# EAGLE design RSeries Lifter v17 (EAGLE 6.4)
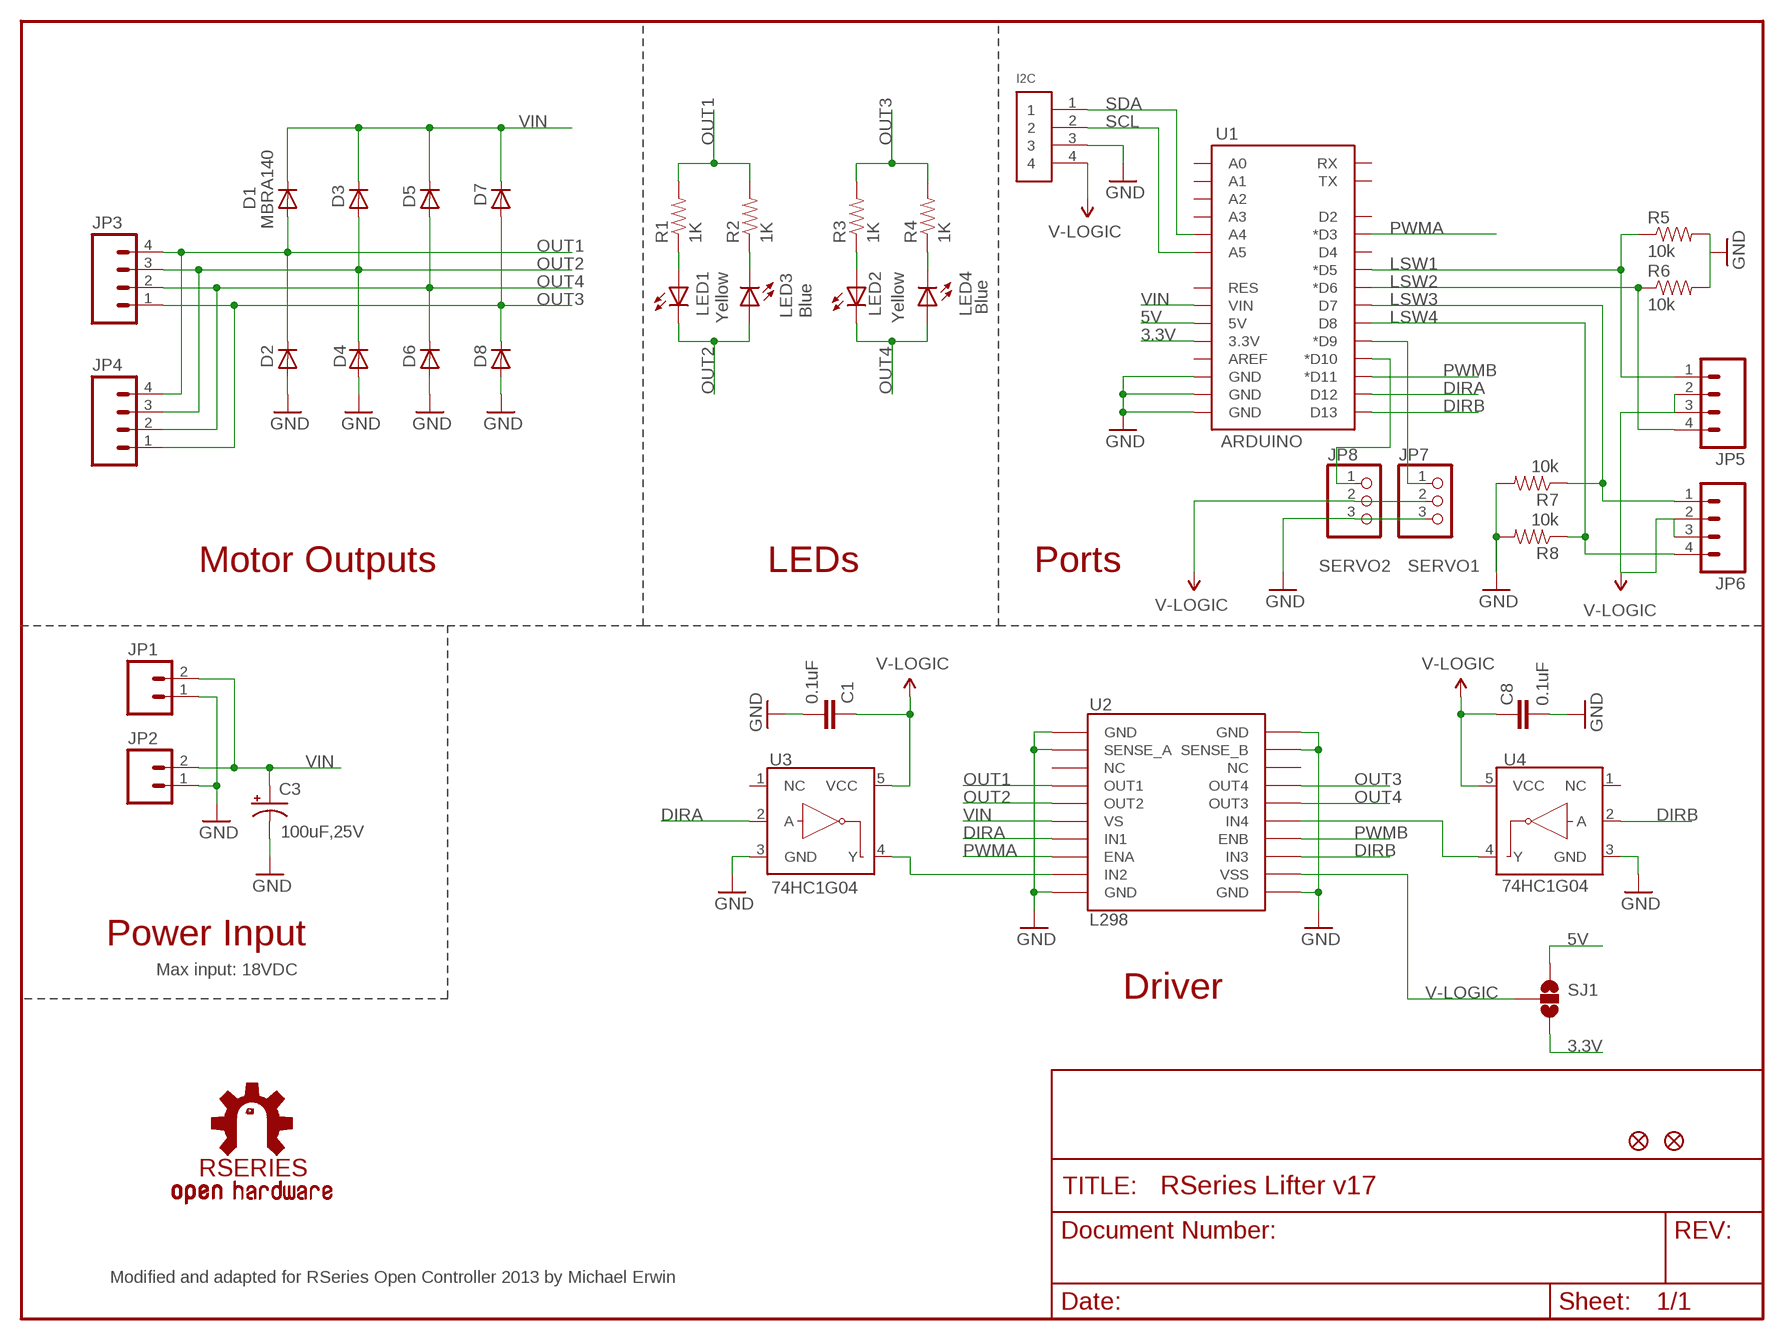
[diagram p0: schematic, sheet 1]

## Parts
C1  0.1uF  CAP0402-CAP  [0402-CAP]
C3  100uF,25V  CAP_POLF80  [NIPPON_F80]
C8  0.1uF  CAP0402-CAP  [0402-CAP]
D1  MBRA140  DIODESMA  [SMA-DIODE]
D2  MBRA140  DIODESMA  [SMA-DIODE]
D3  MBRA140  DIODESMA  [SMA-DIODE]
D4  MBRA140  DIODESMA  [SMA-DIODE]
D5  MBRA140  DIODESMA  [SMA-DIODE]
D6  MBRA140  DIODESMA  [SMA-DIODE]
D7  MBRA140  DIODESMA  [SMA-DIODE]
D8  MBRA140  DIODESMA  [SMA-DIODE]
I2C  1X4-CLEANBIG  [1X04-CLEANBIG]
JP1  M02PTH  [1X02]
JP2  M023.5MM  [SCREWTERMINAL-3.5MM-2]
JP3  M04SCREW  [SCREWTERMINAL-3.5MM-4]
JP4  M04PTH  [1X04]
JP5  M04SCREW  [SCREWTERMINAL-3.5MM-4]
JP6  M04SCREW  [SCREWTERMINAL-3.5MM-4]
JP7  PINHD-1X3CB  [1X03-CLEANBIG]
JP8  PINHD-1X3CB  [1X03-CLEANBIG]
LED1  Yellow  LED1206  [LED-1206]
LED2  Yellow  LED1206  [LED-1206]
LED3  Blue  LED1206  [LED-1206]
LED4  Blue  LED1206  [LED-1206]
R1  1K  RESISTOR  [0805]
R2  1K  RESISTOR  [0805]
R3  1K  RESISTOR  [0805]
R4  1K  RESISTOR  [0805]
R5  10k  RESISTOR0805-RES  [0805]
R6  10k  RESISTOR0805-RES  [0805]
R7  10k  RESISTOR0805-RES  [0805]
R8  10k  RESISTOR0805-RES  [0805]
SJ1  SOLDERJUMPER_2WAYPASTE1&2  [SJ_3_PASTE1&2]
U1  ARDUINO  ARDUINO_SHIELDNOLABELS  [DUEMILANOVE_SHIELD_NOLABELS]
U2  L298  L298_BRIDGE_DRIVER  [POWERSO20]
U3  74HC1G04  INVERTER  [SOT23-5]
U4  74HC1G04  INVERTER  [SOT23-5]
U$3  FIDUCIAL1X2  [FIDUCIAL-1X2]
U$4  FIDUCIAL1X2  [FIDUCIAL-1X2]
U$7  RSERIES-OSHW-LOGOMEDIUM  [RSERIES-OSHW-LOGO-MEDIUM]

## Nets
3.3V: SJ1.3 U1.3.3V
5V [power]: I2C.4 JP5.2 JP5.3 JP6.2 JP6.3 JP7.2 JP8.2 SJ1.1 U1.5V ; supply symbol labelled V-LOGIC
DIRA: U1.D12 U2.P$7(IN1) U3.2(A)
DIRB: U1.D13 U2.P$13(IN3) U4.2(A)
GND [power]: C1.2 C3.- C8.2 D2.A D4.A D6.A D8.A I2C.3 JP1.1 JP2.1 JP7.3 JP8.3 R5.2 R6.2 R7.2 R8.2 U1.GND@0(GND) U1.GND@1(GND) U1.GND@2(GND) U2.P$1(GND) U2.P$2(SENSE_A) U2.P$10(GND) U2.P$11(GND) U2.P$19(SENSE_B) U2.P$20(GND) U3.3(GND) U4.3(GND)
N$1: U2.P$9(IN2) U3.4(Y)
N$2: U2.P$15(IN4) U4.4(Y)
N$3: JP5.1 R5.1 U1.D5(*D5)
N$4: LED1.A R1.1
N$5: LED3.C R2.1
N$6: JP6.1 R7.1 U1.D7
N$7: JP6.4 R8.1 U1.D8
N$8: LED2.A R3.1
N$9: LED4.C R4.1
N$10: JP7.1 U1.D9(*D9)
N$11: JP8.1 U1.D10(*D10)
N$12: JP5.4 R6.1 U1.D6(*D6)
N$13: I2C.1 U1.A4
N$14: I2C.2 U1.A5
OUT1 [power]: D1.A D2.C JP3.4 JP4.4 R1.2 R2.2 U2.P$4(OUT1)
OUT2 [power]: D3.A D4.C JP3.3 JP4.3 LED1.C LED3.A U2.P$5(OUT2)
OUT3 [power]: D7.A D8.C JP3.1 JP4.1 R3.2 R4.2 U2.P$17(OUT4)
OUT4 [power]: D5.A D6.C JP3.2 JP4.2 LED2.C LED4.A U2.P$16(OUT3)
PWMA: U1.D3(*D3) U2.P$8(ENA)
PWMB: U1.D11(*D11) U2.P$14(ENB)
V-LOGIC [power]: C1.1 C8.1 SJ1.2 U2.P$12(VSS) U3.5(VCC) U4.5(VCC)
VIN [power]: C3.+ D1.C D3.C D5.C D7.C JP1.2 JP2.2 U1.VIN U2.P$6(VS)
Unconnected: U1.A0 U1.A1 U1.A2 U1.A3 U1.AREF U1.D2 U1.D4 U1.RES U1.RX U1.TX U2.P$3(NC) U2.P$18(NC) U3.1(NC) U4.1(NC)

## Notes on the sheet
- SDA
- SCL
- LSW1
- LSW2
- LSW3
- LSW4
- Motor Outputs | LEDs | Ports | SERVO2 | SERVO1
- Power Input
- Max input: 18VDC
- Driver
- Modified and adapted for RSeries Open Controller 2013 by Michael Erwin

## Library data of the parts
C1 C8 = SparkFun:CAP: Capacitor Standard 0603 ceramic capacitor, and 0.1" leaded capacitor.
C3 = SparkFun:CAP_POL: Capacitor Polarized These are standard SMD and PTH capacitors. Normally 10uF, 47uF, and 100uF in electrolytic and tantalum varieties. Always verify the external diameter of the through hole cap, it varies with capacity, voltage, and manufacturer. The EIA devices should be standard.
D1-D8 = SparkFun:DIODE: Diode These are standard reverse protection diodes and small signal diodes. SMA package can handle up to about 1A. SOD-323 can handle about 200mA. What the SOD-323 package when ordering, there are some mfgs out there that are 5-pin packages.
I2C = adafruit:1X4: 4-pin connector
JP1 JP2 = SparkFun:M02: Header 2 Standard 2-pin 0.1" header. Use with straight break away headers (SKU : PRT-00116), right angle break away headers (PRT-00553), swiss pins (PRT-00743), machine pins (PRT-00117), and female headers (PRT-00115). Molex polarized connector foot print use with SKU : PRT-08233 with associated crimp pins and housings.
JP3-JP6 = SparkFun:M04: Header 4 Standard 4-pin 0.1" header. Use with straight break away headers (SKU : PRT-00116), right angle break away headers (PRT-00553), swiss pins (PRT-00743), machine pins (PRT-00117), and female headers (PRT-00115). Molex polarized connector foot print use with SKU : PRT-08231 with associated crimp pins and housings.
JP7 JP8 = adafruit:PINHD-1X3: PIN HEADER
LED1-LED4 = SparkFun:LED: LEDs Standard schematic elements and footprints for 5mm, 3mm, 1206, and 0603 sized LEDs. 5mm - Spark Fun Electronics SKU : COM-00529 (and others)
R1-R4 = SparkFun:RESISTOR: Resistor
R5-R8 = SparkFun-Passives:RESISTOR: Resistor
SJ1 = SparkFun:SOLDERJUMPER_2WAY: Solder Jumper 2 way solder jumper
U1 = SparkFun:ARDUINO_SHIELD
U2 = SparkFun:L298_BRIDGE_DRIVER
U3 U4 = SparkFun:INVERTER: Single inverter, SOT23-5
U$3 U$4 = SparkFun:FIDUCIAL: Fiducial Alignment Points Various fiducial points for machine vision alignment.
U$7 = rseries:RSERIES-OSHW-LOGO

## Net classes
1 power: width 0.61 mm

## Board
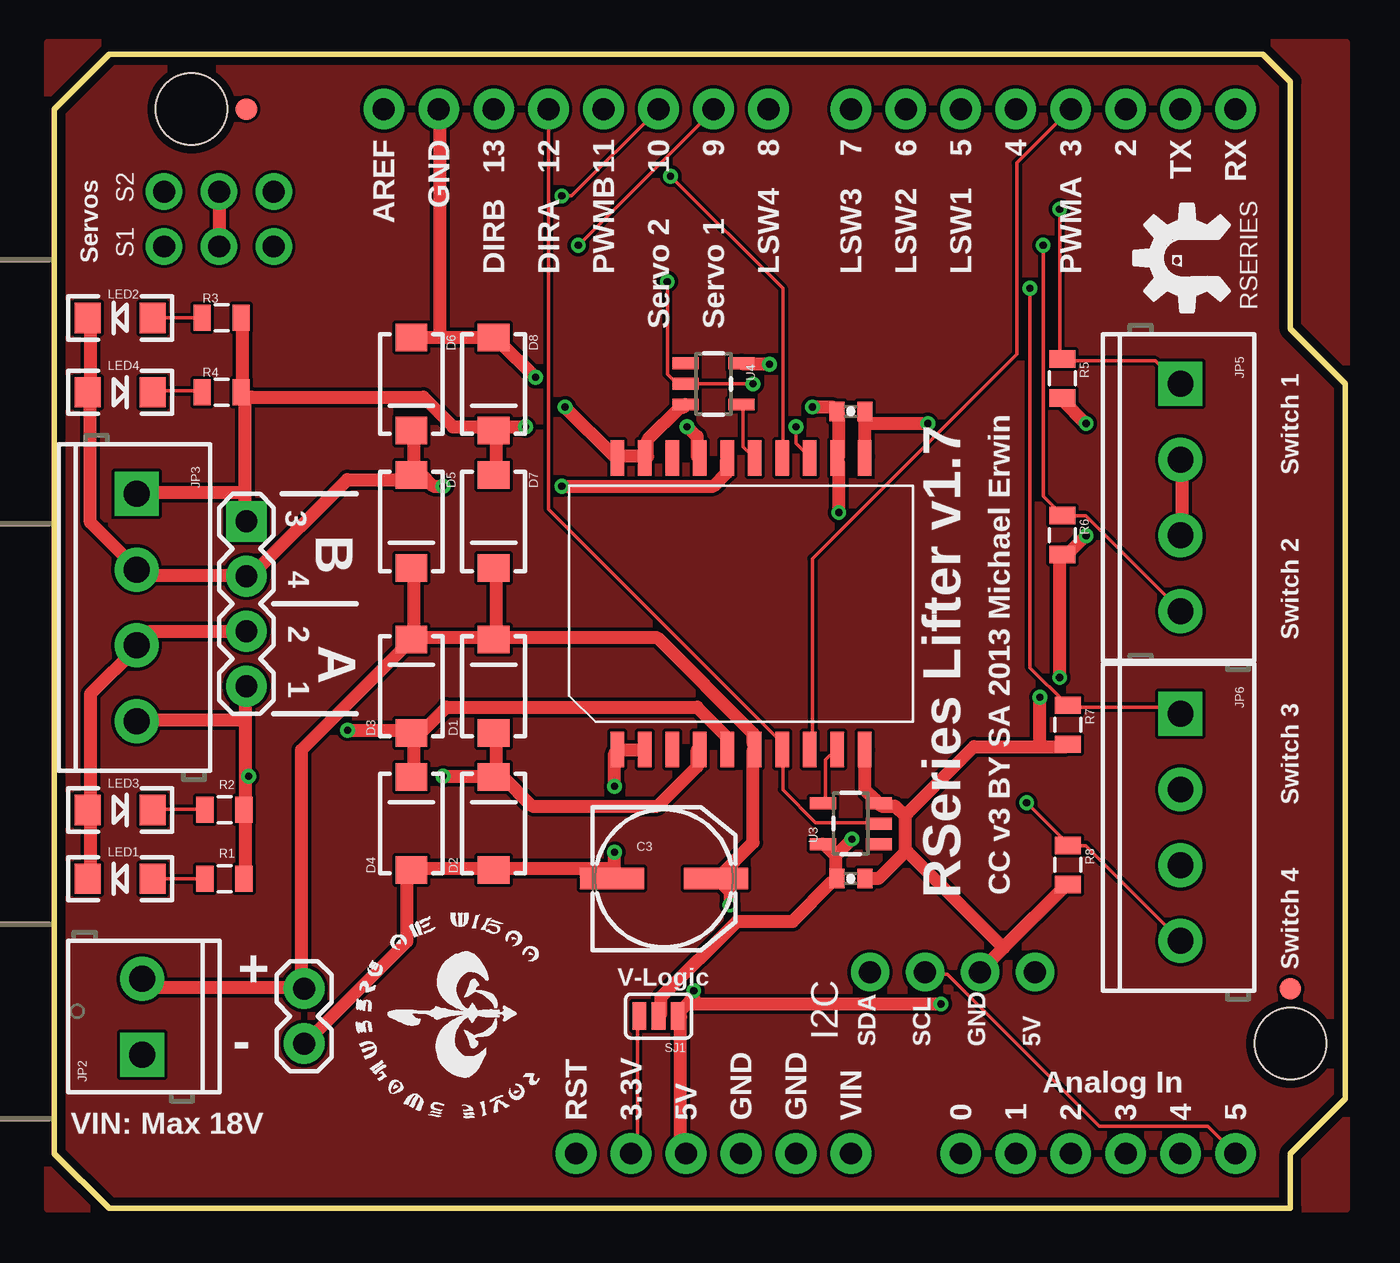
[diagram p1: board, top side]
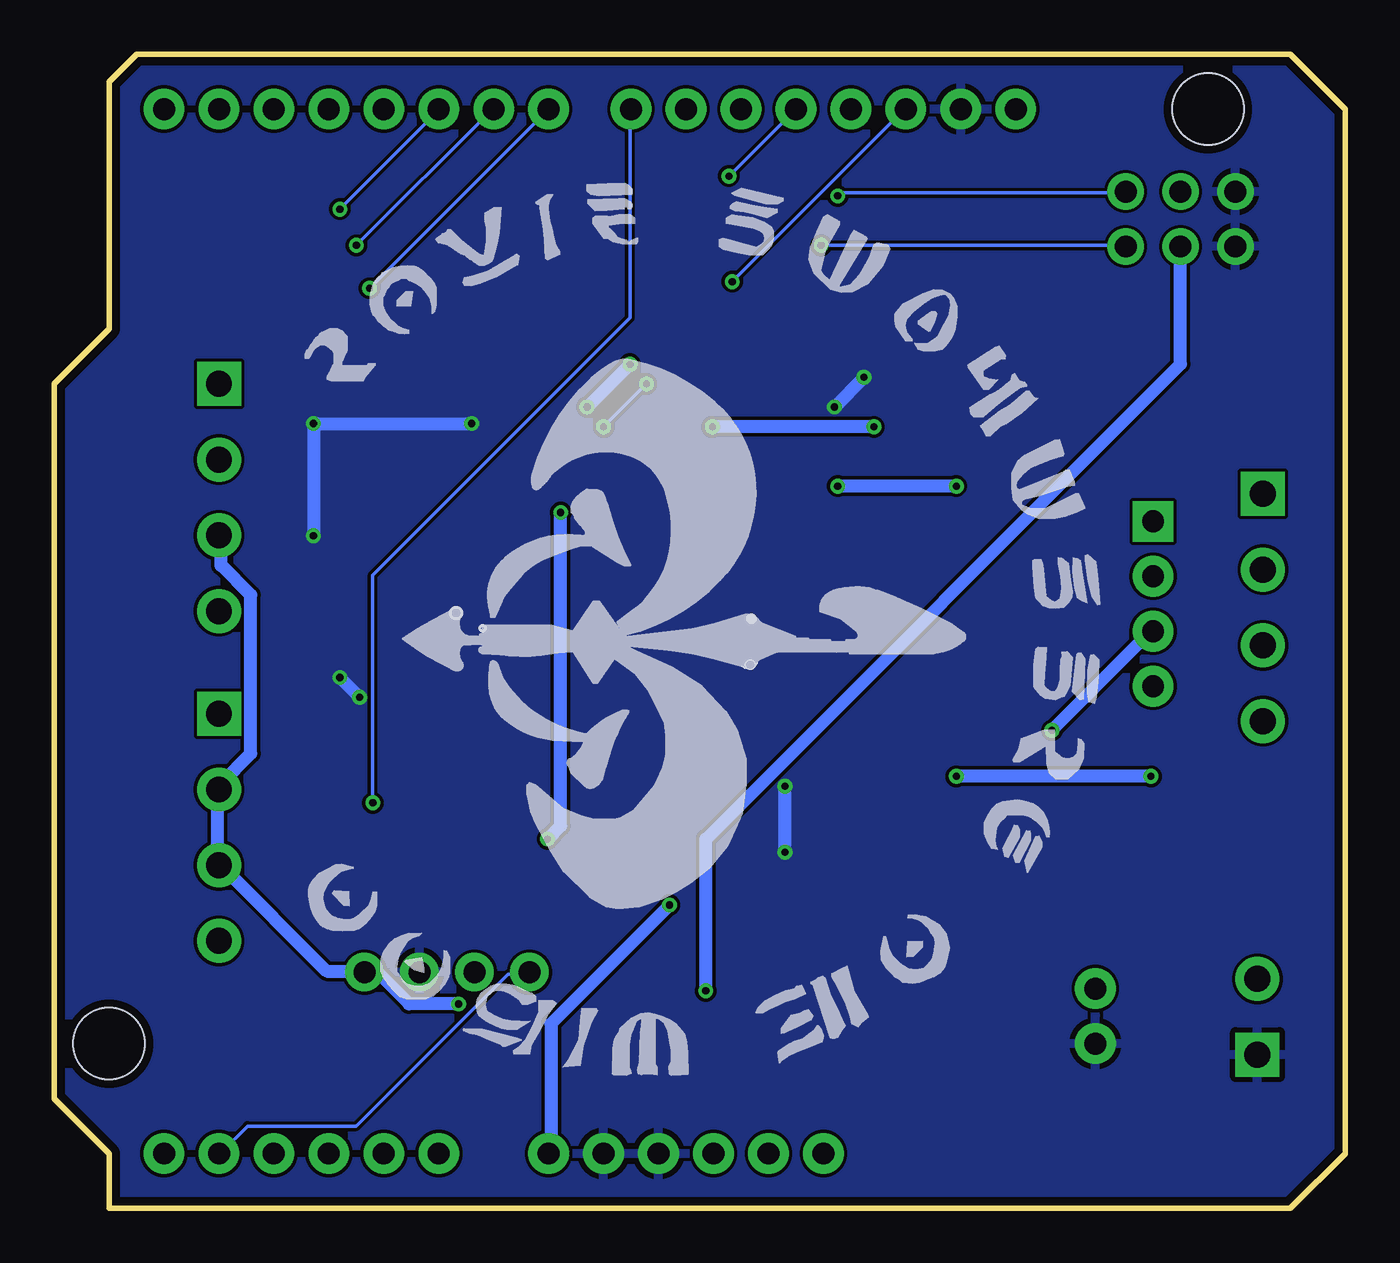
[diagram p2: board, bottom side, seen from below]

Size 59.69 x 53.34 mm. Coordinates in mm from the lower left corner, seen from the top.
Outline: 0,50.8 0,2.54 2.54,0 57.15,0 57.15,2.54 59.69,5.08 59.69,38.1 57.15,40.64 57.15,52.07 55.88,53.34 2.54,53.34 0,50.8
Copper layers (1*16): Top 0.0356mm / dielectric 1.5011mm / Bottom 0.0356mm
Design rules "LaenPCBOrder *": minimum track width 6mil, minimum drill 13mil, track to track 6mil, track to pad 6mil, pad to pad 6mil, via to via 6mil, smd to smd 6mil, copper to edge 15mil, drill to drill 6mil, minimum pad ring 7mil, minimum via ring 7mil, stop-mask expansion 4mil, vias tented up to drill 0mil, thermal gap 10mil

### Footprints (pad centres in the part's own frame; a part is rotated, then mirrored left to right if it is on the bottom)
0402-CAP = smd 0.7 x 0.9: 1 -0.65,0; 2 0.65,0
NIPPON_F80 = smd 2.95 x 1: + 2.4,0; - -2.4,0
SMA-DIODE = smd 1.27 x 1.47: A -2.15,0; C 2.15,0
1X04-CLEANBIG = drill 1.016 pad 1.778: 1 -3.81,0; 2 -1.27,0; 3 1.27,0; 4 3.81,0
1X02 = drill 1.016 pad 1.88: 1 0,0; 2 2.54,0
SCREWTERMINAL-3.5MM-2 = drill 1.2 pad 2.032 square: 1 0,0 | drill 1.2 pad 2.032: 2 3.5,0
SCREWTERMINAL-3.5MM-4 = drill 1.2 pad 2.032 square: 1 0,0 | drill 1.2 pad 2.032: 2 3.5,0; 3 7,0; 4 10.5,0
1X04 = drill 1.016 pad 1.88 square: 1 0,0 | drill 1.016 pad 1.88: 2 2.54,0; 3 5.08,0; 4 7.62,0
1X03-CLEANBIG = drill 1.016 pad 1.676: 1 -2.54,0; 2 0,0; 3 2.54,0
LED-1206 = smd 1.2 x 1.4: A -1.5,0; C 1.5,0
0805 = smd 0.8 x 1.2: 1 -0.9,0; 2 0.9,0
SJ_3_PASTE1&2 = smd 0.635 x 1.27: 1 -0.889,0; 2 0,0; 3 0.889,0
DUEMILANOVE_SHIELD_NOLABELS = drill 1.016 pad 1.88: 3.3V 50.8,26.67; 5V 50.8,29.21; A0 50.8,41.91; A1 50.8,44.45; A2 50.8,46.99; A3 50.8,49.53; A4 50.8,52.07; A5 50.8,54.61; AREF 2.54,15.24; D2 2.54,49.53; D3 2.54,46.99; D4 2.54,44.45; D5 2.54,41.91; D6 2.54,39.37; D7 2.54,36.83; D8 2.54,33.02; D9 2.54,30.48; D10 2.54,27.94; D11 2.54,25.4; D12 2.54,22.86; D13 2.54,20.32; GND@0 50.8,31.75; GND@1 50.8,34.29; GND@2 2.54,17.78; RES 50.8,24.13; RX 2.54,54.61; TX 2.54,52.07; VIN 50.8,36.83 | hole 3.302: 45.72,57.15; 2.54,6.35
POWERSO20 = smd 1.651 x 0.635: P$1 -6.731,5.715; P$2 -6.731,4.445; P$3 -6.731,3.175; P$4 -6.731,1.905; P$5 -6.731,0.635; P$6 -6.731,-0.635; P$7 -6.731,-1.905; P$8 -6.731,-3.175; P$9 -6.731,-4.445; P$10 -6.731,-5.715; P$11 6.731,-5.715; P$12 6.731,-4.445; P$13 6.731,-3.175; P$14 6.731,-1.905; P$15 6.731,-0.635; P$16 6.731,0.635; P$17 6.731,1.905; P$18 6.731,3.175; P$19 6.731,4.445; P$20 6.731,5.715
SOT23-5 = smd 0.55 x 1.2: 1 -0.95,-1.3; 2 0,-1.3; 3 0.95,-1.3; 4 0.95,1.3; 5 -0.95,1.3
FIDUCIAL-1X2 = smd 1 x 1: 1 0,0

### Placement (x,y rotation side)
C1  36.83,15.24 0 top
C3  28.19,15.24 0 top
C8  36.83,36.83 0 top
D1  20.32,24.13 90 top
D2  20.32,17.78 90 top
D3  16.51,24.13 90 top
D4  16.51,17.78 90 top
D5  16.51,31.75 270 top
D6  16.51,38.1 270 top
D7  20.32,31.75 270 top
D8  20.32,38.1 270 top
I2C  41.53,10.92 0 top
JP1  11.56,7.62 90 top
JP2  4.06,7.11 90 top
JP3  3.81,33.02 270 top
JP4  8.89,31.75 270 top
JP5  52.07,38.1 270 top
JP6  52.07,22.86 270 top
JP7  7.62,44.45 180 top
JP8  7.62,46.99 180 top
LED1  3.05,15.24 180 top
LED2  3.05,41.15 180 top
LED3  3.05,18.41 0 top
LED4  3.05,37.72 0 top
R1  7.87,15.24 0 top
R2  7.87,18.41 0 top
R3  7.75,41.15 0 top
R4  7.75,37.72 0 top
R5  46.61,38.35 270 top
R6  46.61,31.11 270 top
R7  46.86,22.35 270 top
R8  46.86,15.88 270 top
SJ1  27.94,8.89 180 top
U1  0,53.34 270 top
U2  31.75,27.94 90 top
U3  36.83,17.78 90 top
U4  30.48,38.1 270 top
U$3  57.15,10.16 0 top
U$4  8.89,50.8 0 top
U$6  [ROYAL-ENGINEERS-OF-NABOO-SMALL]  22.73,4.06 90 top
U$7  52.32,43.81 90 top
U$10  [ROYAL-ENGINEERS-OF-NABOO-BOTTOM-LARGE]  45.59,26.16 270 bottom

### Tracks (layer width: path | path; a pad name or v marks a point on that pad's centre or on a via)
3.3V
  Top 0.152: SJ1.3 26.98,8.84 26.98,2.9 26.67,2.59 U1.3.3V
5V  (via drill 0.33)
  Top 0.61: JP5.3 52.12,31.24 52.12,34.59 JP5.2 | JP7.2 7.62,44.5 7.62,46.94 JP8.2 | U1.5V 29.11,2.59 28.96,2.74 28.96,8.84 SJ1.1 28.96,9.14 29.41,9.6 | v29.57,10.06 29.57,9.75 29.41,9.6 | v41,9.45 29.57,9.45 29.41,9.6
  Bottom 0.61: JP5.3 51.97,31.09 51.97,29.72 50.6,28.35 50.6,21.03 51.97,19.66 JP6.2 52.12,19.36 52.12,16.15 JP6.3 51.97,15.85 47.09,10.97 45.41,10.97 I2C.4 45.11,10.82 44.65,10.82 43.28,9.45 v41,9.45 | v29.57,10.06 29.57,17.07 7.62,39.01 7.62,44.35 JP7.2
DIRA
  Top 0.152: U3.2 38.1,17.83 35.2,17.83 33.68,19.36 33.68,21.18 U2.P$7 33.53,21.34 33.53,21.64 22.86,32.31 22.86,50.75 U1.D12
DIRB  (via drill 0.33)
  Top 0.152: v32.31,38.1 29.26,38.1 U4.2 29.11,38.1 28.8,38.1 28.35,38.56 v28.35,42.82 | v34.29,36.12 34.29,35.36 34.9,34.75 U2.P$13
  Bottom 0.152: v34.29,36.12 v32.31,38.1 | v28.35,42.82 20.42,50.75 U1.D13
GND  (via drill 0.33)
  Top 0.61: 17.83,40.23 20.27,40.23 D8.A 20.57,40.08 v22.25,38.41 | 17.83,40.23 16.61,40.23 D6.A | U4.3 29.11,37.03 28.96,37.03 27.43,35.51 27.43,34.75 U2.P$19 27.13,34.75 26.06,34.75 U2.P$20 25.91,34.75 v23.62,37.03 | U2.P$2 27.28,21.18 26.06,21.18 U2.P$1 25.91,21.03 v25.91,19.51 | v25.91,16.46 25.91,15.24 C3.- 25.76,15.7 20.57,15.7 D2.A 20.27,15.7 16.61,15.7 D4.A 16.31,15.39 16.31,12.34 11.58,7.62 JP1.1 | 37.49,36.27 37.49,34.75 U2.P$11 | 37.49,36.27 37.49,36.73 C8.2 | v47.7,31.09 46.94,30.33 46.63,30.33 R6.2 46.48,30.02 v46.48,24.54 | v47.7,36.27 46.63,37.34 R5.2 | v40.39,36.27 37.64,36.27 37.49,36.27 | 43.89,12.04 42.82,10.97 I2C.3 | 43.89,12.04 46.79,14.94 R8.2 | 39.32,16.46 38.1,15.24 C1.2 | 39.32,18.14 39.32,16.46 | 39.32,18.14 38.86,18.59 38.25,18.59 U3.3 37.95,18.9 37.49,19.36 37.49,21.18 U2.P$10 | 45.57,21.34 42.52,21.34 39.47,18.29 39.32,18.14 | 45.57,21.34 46.79,21.34 R7.2 | 43.89,12.04 43.74,12.19 39.47,16.46 39.32,16.46 | v45.57,23.62 45.57,21.49 45.57,21.34 | 17.83,40.23 17.83,40.39 17.83,50.75 U1.GND@2
  Bottom 0.61: v23.62,37.03 v22.25,38.41 | v25.91,16.46 v25.91,19.51 | v47.7,31.09 v47.7,36.27 47.55,36.27 v40.39,36.27 | v45.57,23.62 v46.48,24.54
  pour Bottom: -0.25,53.85 59.69,53.85 59.69,37.59 59.69,0 -0.25,0
N$1
  Top 0.152: U3.4 35.66,18.75 35.66,20.73 36.12,21.18 U2.P$9
N$2
  Top 0.152: U4.4 31.85,37.03 31.85,35.2 32.31,34.75 U2.P$15
N$3  (via drill 0.33)
  Top 0.152: JP5.1 51.97,38.1 50.9,39.17 46.63,39.17 R5.1 46.48,39.32 v46.48,46.18
  Bottom 0.152: v46.48,46.18 41.91,50.75 U1.D5
N$4
  Top 0.152: R1.1 6.86,15.24 4.57,15.24 LED1.A
N$5
  Top 0.152: R2.1 6.86,18.44 4.57,18.44 LED3.C
N$6  (via drill 0.33)
  Top 0.152: JP6.1 51.97,22.86 51.66,23.16 46.94,23.16 R7.1 46.79,23.32 45.11,24.99 v45.11,42.52
  Bottom 0.152: v45.11,42.52 36.88,50.75 U1.D7
N$7  (via drill 0.33)
  Top 0.152: JP6.4 51.97,12.5 47.7,16.76 46.94,16.76 R8.1 46.79,16.92 v44.96,18.75
  Bottom 0.152: v44.96,18.75 44.96,29.26 33.07,41.15 33.07,50.75 U1.D8
N$8
  Top 0.152: R3.1 6.71,41.15 4.57,41.15 LED2.A
N$9
  Top 0.152: R4.1 6.71,37.8 4.57,37.8 LED4.C
N$10  (via drill 0.33)
  Top 0.152: v24.23,44.5 30.48,50.75 U1.D9
  Bottom 0.152: v24.23,44.5 10.21,44.5 JP7.1
N$11  (via drill 0.33)
  Top 0.152: v23.47,46.79 23.93,46.79 27.89,50.75 U1.D10
  Bottom 0.152: v23.47,46.79 23.32,46.94 10.21,46.94 JP8.1
N$12  (via drill 0.33)
  Top 0.152: JP5.4 51.97,27.74 47.7,32 46.63,32 R6.1 46.48,32.16 45.72,32.92 v45.72,44.5
  Bottom 0.152: v45.72,44.5 39.47,50.75 U1.D6
N$13
  Bottom 0.152: I2C.1 37.8,10.82 38.71,10.82 45.72,3.81 50.75,3.81 51.97,2.59 U1.A4
N$14
  Top 0.152: I2C.2 40.39,10.82 41.3,10.82 48.31,3.81 53.34,3.81 54.56,2.59 U1.A5
N$15
  pour Top: -0.25,53.85 59.69,53.85 59.69,0 -0.25,0
OUT1  (via drill 0.33)
  Top 0.61: D2.C 20.42,19.96 20.42,21.95 D1.A | U2.P$4 29.72,21.18 29.72,20.42 27.89,18.59 22.1,18.59 20.73,19.96 D2.C | R1.2 8.84,15.24 8.84,18.29 R2.2 8.84,18.59 8.84,19.96 | 8.84,22.55 8.84,24.08 JP4.4 | 8.84,22.55 8.84,19.96 | JP3.4 3.81,22.55 8.69,22.55 8.84,22.55 | v17.98,19.96 20.12,19.96 D2.C | v8.99,19.96 8.84,19.96
  Bottom 0.61: v8.99,19.96 v17.98,19.96
OUT2  (via drill 0.33)
  Top 0.61: D4.C 16.61,19.96 16.61,21.95 D3.A | U2.P$5 31.09,21.34 31.09,21.79 29.72,23.16 18.14,23.16 16.92,21.95 D3.A | LED1.C 1.68,15.24 1.68,18.29 LED3.A 1.68,18.59 1.68,23.77 3.81,25.91 JP3.3 3.96,26.21 4.42,26.67 8.84,26.67 JP4.3 | v13.56,22.1 16.31,22.1 D3.A
  Bottom 0.61: v13.56,22.1 8.99,26.67 JP4.3
OUT3  (via drill 0.33)
  Top 0.61: D7.A 20.42,33.98 20.42,35.81 D8.C | v29.26,36.12 29.72,35.66 29.72,34.75 U2.P$17 | v21.79,36.12 20.57,36.12 D8.C | R3.2 8.69,41.15 8.69,37.8 R4.2 8.84,37.49 | 8.84,33.07 8.84,31.85 JP4.1 | 8.84,33.07 8.84,37.49 | JP3.1 3.81,33.07 8.69,33.07 8.84,33.07 | D8.C 20.12,36.12 18.44,36.12 17.07,37.49 9.14,37.49 8.84,37.49
  Bottom 0.61: v21.79,36.12 v29.26,36.12
OUT4  (via drill 0.33)
  Top 0.61: D5.A 16.61,33.98 16.61,35.81 D6.C | v23.47,33.38 30.48,33.38 31.09,33.98 31.09,34.59 U2.P$16 | v17.98,33.38 17.53,33.38 16.92,33.98 D5.A | LED2.C 1.68,41.15 1.68,37.8 LED4.A 1.68,37.49 1.68,31.7 3.81,29.57 JP3.2 3.96,29.26 8.84,29.26 JP4.2 9.14,29.26 13.56,33.68 16.31,33.68 D5.A
  Bottom 0.61: v17.98,33.38 v23.47,33.38
PWMA
  Top 0.152: U2.P$8 35.05,21.34 35.05,30.02 44.5,39.47 44.5,48.31 46.94,50.75 U1.D3
PWMB  (via drill 0.33)
  Top 0.152: v28.5,47.7 33.68,42.52 33.68,34.75 U2.P$14
  Bottom 0.152: v28.5,47.7 25.45,50.75 U1.D11
V-LOGIC  (via drill 0.33)
  Top 0.61: v33.07,39.01 31.85,39.01 U4.5 | v35.05,37.03 35.97,37.03 C8.1 36.27,36.73 36.27,34.75 U2.P$12 36.27,34.44 v36.27,32.16 | 36.12,16.31 36.12,15.24 C1.1 35.97,15.09 34.14,13.26 31.55,13.26 28.04,9.75 28.04,8.99 SJ1.2 | 36.12,16.31 35.66,16.76 U3.5 | v36.88,17.07 36.27,16.46 36.12,16.31
  Bottom 0.61: v35.05,37.03 v33.07,39.01 | v36.27,32.16 36.27,17.68 v36.88,17.07
VIN  (via drill 0.33)
  Top 0.61: JP2.2 4.12,10.52 4.42,10.21 11.43,10.21 JP1.2 11.43,10.52 11.43,21.18 16.31,26.06 D3.C | D3.C 16.61,26.36 16.61,29.57 D5.C | D1.C 20.42,26.36 20.42,29.57 D7.C | D3.C 16.92,26.36 20.12,26.36 D1.C | v31.24,14.02 31.24,14.63 30.79,15.09 C3.+ 30.63,15.24 32.31,16.92 32.31,21.18 U2.P$6 32.31,21.49 32.31,21.95 27.89,26.36 20.73,26.36 D1.C
  Bottom 0.61: v31.24,14.02 36.73,8.53 36.73,2.59 U1.VIN

### Text on the board
tPlace: RSERIES
tValues: L298P013TR
_tsilk: AREF | GND | 13 | 12 | 11 | 10 | 9 | 8 | 7 | 6 | 5 | 4 | 3 | 2 | TX | RX | S2 | Servos | S1 | DIRB | DIRA | PWMB | LSW4 | LSW3 | LSW2 | LSW1 | PWMA | Servo 2 | Servo 1 | Switch 1 | 3 | B | 4 | 2 | A | Switch 2 | 1 | Switch 3 | RSeries Lifter v1.7 | CC v3 BY SA 2013 Michael Erwin | + | Switch 4 | V-Logic | - | SDA | SCL | GND | 5V | Analog In | RST | 3.3V | 5V | GND | GND | VIN | 0 | 1 | 2 | 3 | 4 | 5 | VIN: Max 18V